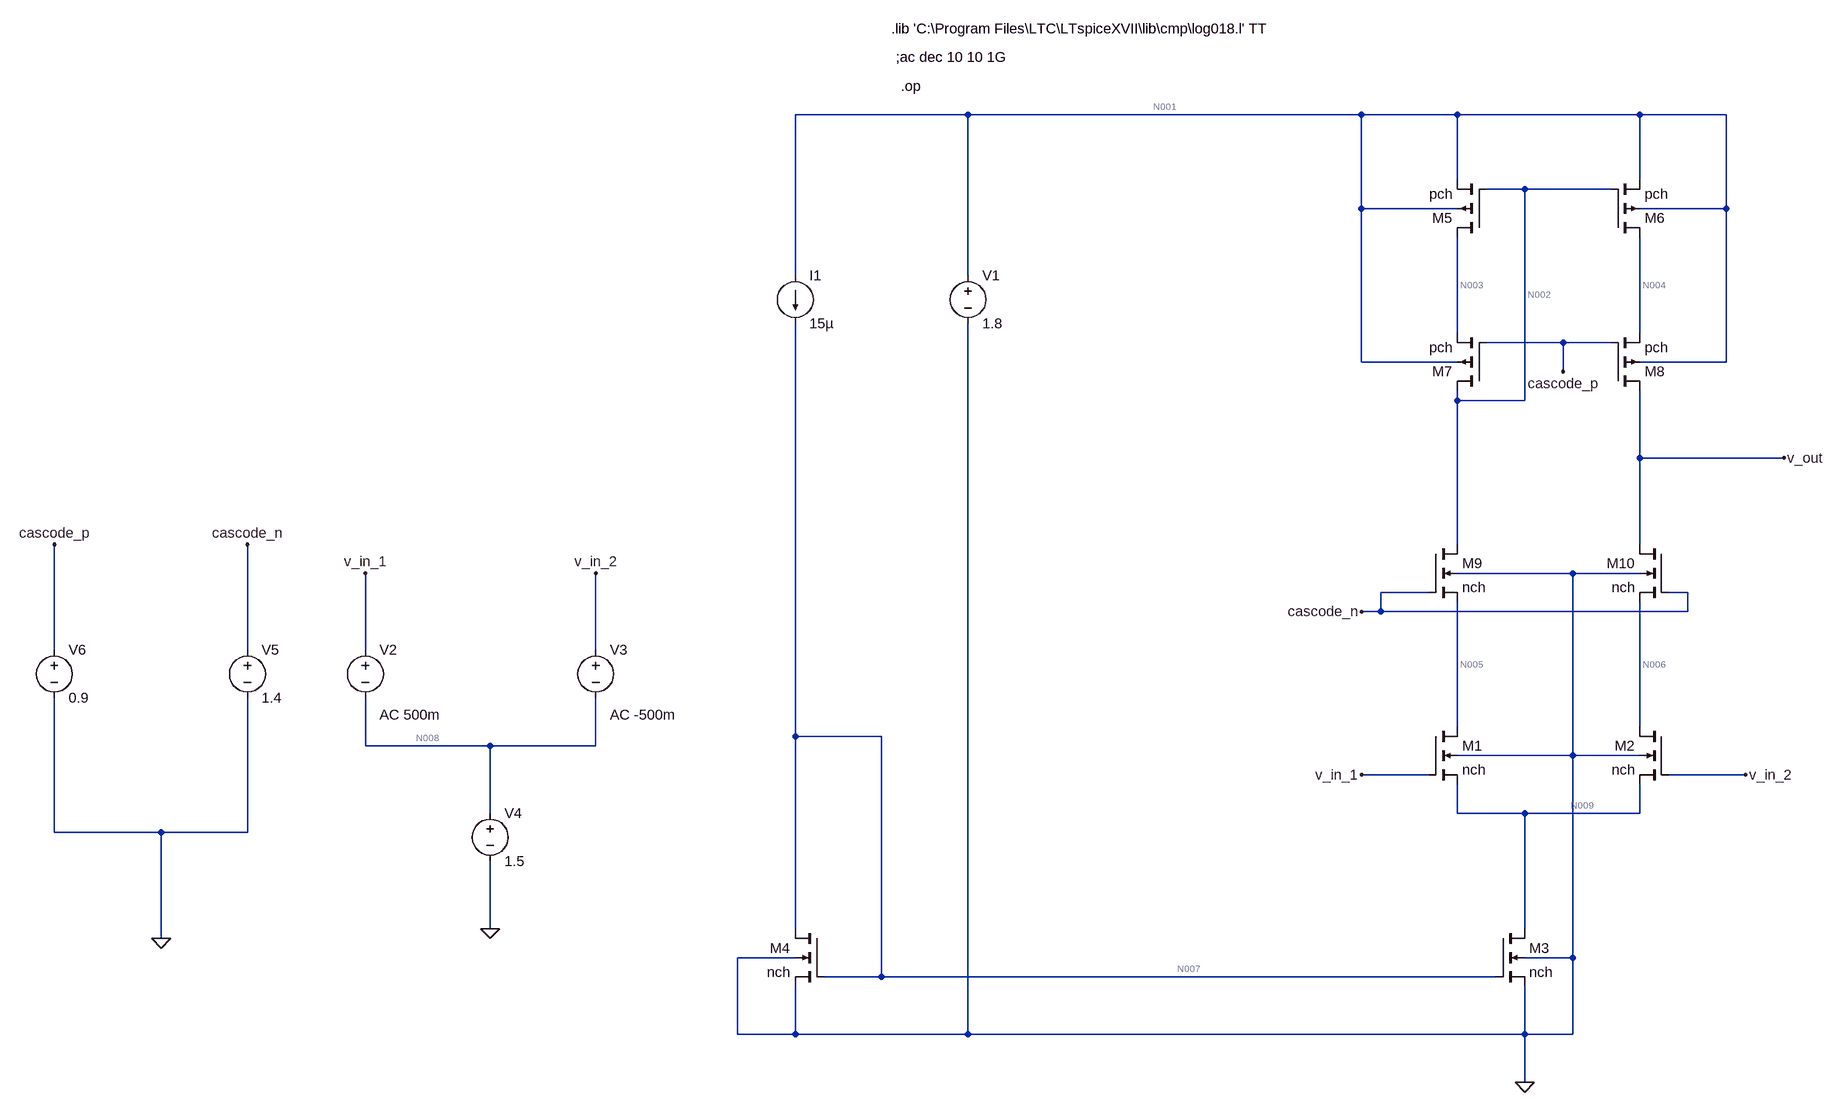
[diagram p0: schematic differential-pair-current-mirror.asc]
differential-pair-current-mirror.asc, the LTspice schematic file:
Version 4
SHEET 1 1744 1748
WIRE -208 48 -496 48
WIRE 448 48 -208 48
WIRE 608 48 448 48
WIRE 912 48 608 48
WIRE 1056 48 912 48
WIRE 608 176 608 48
WIRE 912 176 912 48
WIRE 720 192 656 192
WIRE 864 192 720 192
WIRE 448 224 448 48
WIRE 608 224 448 224
WIRE 1056 224 1056 48
WIRE 1056 224 912 224
WIRE -496 336 -496 48
WIRE -208 336 -208 48
WIRE 608 432 608 272
WIRE 912 432 912 272
WIRE 784 448 656 448
WIRE 864 448 784 448
WIRE 448 480 448 224
WIRE 608 480 448 480
WIRE 1056 480 1056 224
WIRE 1056 480 912 480
WIRE 784 496 784 448
WIRE 608 544 608 528
WIRE 720 544 720 192
WIRE 720 544 608 544
WIRE 912 640 912 528
WIRE 1152 640 912 640
WIRE 608 816 608 544
WIRE 912 816 912 640
WIRE 800 864 608 864
WIRE 912 864 800 864
WIRE 560 896 480 896
WIRE 992 896 960 896
WIRE 480 928 480 896
WIRE 480 928 448 928
WIRE 992 928 992 896
WIRE 992 928 480 928
WIRE -2048 992 -2048 816
WIRE -1696 992 -1696 816
WIRE -1376 992 -1376 864
WIRE -992 992 -992 864
WIRE 608 1120 608 912
WIRE 912 1120 912 912
WIRE -496 1136 -496 416
WIRE -352 1136 -496 1136
WIRE -1376 1152 -1376 1072
WIRE -1168 1152 -1376 1152
WIRE -992 1152 -992 1072
WIRE -992 1152 -1168 1152
WIRE 800 1168 800 864
WIRE 800 1168 608 1168
WIRE 912 1168 800 1168
WIRE 560 1200 448 1200
WIRE 1088 1200 960 1200
WIRE -1168 1264 -1168 1152
WIRE 608 1264 608 1216
WIRE 720 1264 608 1264
WIRE 912 1264 912 1216
WIRE 912 1264 720 1264
WIRE -2048 1296 -2048 1072
WIRE -1840 1296 -2048 1296
WIRE -1696 1296 -1696 1072
WIRE -1696 1296 -1840 1296
WIRE -1168 1472 -1168 1344
WIRE -496 1472 -496 1136
WIRE 720 1472 720 1264
WIRE -1840 1488 -1840 1296
WIRE -496 1520 -592 1520
WIRE 800 1520 800 1168
WIRE 800 1520 720 1520
WIRE -352 1552 -352 1136
WIRE -352 1552 -448 1552
WIRE 672 1552 -352 1552
WIRE -592 1648 -592 1520
WIRE -496 1648 -496 1568
WIRE -496 1648 -592 1648
WIRE -208 1648 -208 416
WIRE -208 1648 -496 1648
WIRE 720 1648 720 1568
WIRE 720 1648 -208 1648
WIRE 800 1648 800 1520
WIRE 800 1648 720 1648
WIRE 720 1728 720 1648
FLAG 720 1728 0
FLAG -1168 1472 0
FLAG 448 1200 v_in_1
FLAG 1088 1200 v_in_2
FLAG -1376 864 v_in_1
FLAG -992 864 v_in_2
FLAG 1152 640 v_out
FLAG 784 496 cascode_p
FLAG 448 928 cascode_n
FLAG -2048 816 cascode_p
FLAG -1696 816 cascode_n
FLAG -1840 1488 0
DATAFLAG 784 448 ""
DATAFLAG 512 1200 ""
DATAFLAG 1040 1200 ""
DATAFLAG 768 1264 ""
DATAFLAG 512 896 ""
DATAFLAG 624 1552 ""
DATAFLAG -432 1136 ""
DATAFLAG 608 624 ""
DATAFLAG 912 608 ""
DATAFLAG 608 1024 ""
DATAFLAG 608 352 ""
DATAFLAG 912 336 ""
DATAFLAG 912 1024 ""
DATAFLAG -496 1456 "Id(M4)"
DATAFLAG 720 1392 "Id(M3)"
SYMBOL nmos4 560 1120 R0
SYMATTR InstName M1
SYMATTR Value nch
SYMATTR Value2 l=1u w=15u
SYMBOL nmos4 960 1120 M0
SYMATTR InstName M2
SYMATTR Value nch
SYMATTR Value2 l=1u w=15u
SYMBOL nmos4 672 1472 R0
SYMATTR InstName M3
SYMATTR Value nch
SYMATTR Value2 l=1u w=30u
SYMBOL nmos4 -448 1472 M0
SYMATTR InstName M4
SYMATTR Value nch
SYMATTR Value2 l=1u w=15u
SYMBOL pmos4 656 272 R180
SYMATTR InstName M5
SYMATTR Value pch
SYMATTR Value2 l=1u w=15u
SYMBOL pmos4 864 272 M180
SYMATTR InstName M6
SYMATTR Value pch
SYMATTR Value2 l=1u w=15u
SYMBOL current -496 336 R0
SYMATTR InstName I1
SYMATTR Value 15µ
SYMBOL voltage -208 320 R0
WINDOW 123 0 0 Left 0
WINDOW 39 0 0 Left 0
SYMATTR InstName V1
SYMATTR Value 1.8
SYMBOL voltage -1376 976 R0
WINDOW 123 24 124 Left 2
WINDOW 39 0 0 Left 0
SYMATTR Value2 AC 500m
SYMATTR InstName V2
SYMATTR Value ""
SYMBOL voltage -1168 1248 R0
WINDOW 123 0 0 Left 0
WINDOW 39 0 0 Left 0
SYMATTR InstName V4
SYMATTR Value 1.5
SYMBOL voltage -992 976 R0
WINDOW 123 24 124 Left 2
WINDOW 39 0 0 Left 0
SYMATTR Value2 AC -500m
SYMATTR InstName V3
SYMATTR Value ""
SYMBOL pmos4 656 528 R180
SYMATTR InstName M7
SYMATTR Value pch
SYMATTR Value2 l=1u w=15u
SYMBOL pmos4 864 528 M180
SYMATTR InstName M8
SYMATTR Value pch
SYMATTR Value2 l=1u w=15u
SYMBOL nmos4 560 816 R0
SYMATTR InstName M9
SYMATTR Value nch
SYMATTR Value2 l=1u w=15u
SYMBOL nmos4 960 816 M0
SYMATTR InstName M10
SYMATTR Value nch
SYMATTR Value2 l=1u w=15u
SYMBOL voltage -1696 976 R0
SYMATTR InstName V5
SYMATTR Value 1.4
SYMBOL voltage -2048 976 R0
WINDOW 123 0 0 Left 0
WINDOW 39 0 0 Left 0
SYMATTR InstName V6
SYMATTR Value 0.9
TEXT -336 -96 Left 2 !.lib 'C:\\Program Files\\LTC\\LTspiceXVII\\lib\\cmp\\log018.l' TT
TEXT -328 -48 Left 2 !;ac dec 10 10 1G
TEXT -320 0 Left 2 !.op

The netlist it stands for:
* differential-pair-current-mirror.asc
M1 N005 v_in_1 N009 0 nch l=1u w=15u
M2 N006 v_in_2 N009 0 nch l=1u w=15u
M3 N009 N007 0 0 nch l=1u w=30u
M4 N007 N007 0 0 nch l=1u w=15u
M5 N003 N002 N001 N001 pch l=1u w=15u
M6 N004 N002 N001 N001 pch l=1u w=15u
I1 N001 N007 15µ
V1 N001 0 1.8
V2 v_in_1 N008 AC 500m
V4 N008 0 1.5
V3 v_in_2 N008 AC -500m
M7 N002 cascode_p N003 N001 pch l=1u w=15u
M8 v_out cascode_p N004 N001 pch l=1u w=15u
M9 N002 cascode_n N005 0 nch l=1u w=15u
M10 v_out cascode_n N006 0 nch l=1u w=15u
V5 cascode_n 0 1.4
V6 cascode_p 0 0.9
.model NMOS NMOS
.model PMOS PMOS
.lib standard.mos
.lib 'C:\Program Files\LTC\LTspiceXVII\lib\cmp\log018.l' TT
;ac dec 10 10 1G
.op
.backanno
.end

* Results of the author's LTspice run, read from the files saved beside the schematic
* Operating Point:
*   V(n005) = 720.9 mV
*   V(v_in_1) = 1.5 V
*   V(n009) = 700.9 mV
*   V(n006) = 720.9 mV
*   V(v_in_2) = 1.5 V
*   V(n007) = 499.4 mV
*   V(n003) = 1.589 V
*   V(n002) = 1.174 V
*   V(n001) = 1.8 V
*   V(n004) = 1.589 V
*   V(n008) = 1.5 V
*   V(cascode_p) = 900 mV
*   V(v_out) = 1.174 V
*   V(cascode_n) = 1.4 V
*   Id(M8) = -15.27 µA
*   Ig(M8) = 0 A
*   Ib(M8) = 857.1 fA
*   Is(M8) = 15.27 µA
*   Id(M7) = -15.27 µA
*   Ig(M7) = 0 A
*   Ib(M7) = 857.1 fA
*   Is(M7) = 15.27 µA
*   Id(M6) = -15.27 µA
*   Ig(M6) = 0 A
*   Ib(M6) = 220.9 fA
*   Is(M6) = 15.27 µA
*   Id(M5) = -15.27 µA
*   Ig(M5) = 0 A
*   Ib(M5) = 220.9 fA
*   Is(M5) = 15.27 µA
*   Id(M10) = 15.27 µA
*   Ig(M10) = 0 A
*   Ib(M10) = -1.915 pA
*   Is(M10) = -15.27 µA
*   Id(M9) = 15.27 µA
*   Ig(M9) = 0 A
*   Ib(M9) = -1.915 pA
*   Is(M9) = -15.27 µA
*   Id(M4) = 15 µA
*   Ig(M4) = 0 A
*   Ib(M4) = -509.4 fA
*   Is(M4) = -15 µA
*   Id(M3) = 30.54 µA
*   Ig(M3) = 0 A
*   Ib(M3) = -754 fA
*   Is(M3) = -30.54 µA
*   Id(M2) = 15.27 µA
*   Ig(M2) = 0 A
*   Ib(M2) = -1.442 pA
*   Is(M2) = -15.27 µA
*   Id(M1) = 15.27 µA
*   Ig(M1) = 0 A
*   Ib(M1) = -1.442 pA
*   Is(M1) = -15.27 µA
*   I(I1) = 15 µA
*   I(V6) = 0 A
*   I(V5) = 0 A
*   I(V3) = 0 A
*   I(V4) = 0 A
*   I(V2) = 0 A
*   I(V1) = -45.54 µA
* From the log:
*   Semiconductor Device Operating Points:
*                           --- BSIM3 MOSFETS ---
*   Name:        m8          m7          m6          m5          m10
*   Model:      pch.2       pch.2       pch.2       pch.2       nch.2
*   Id:       -1.53e-05   -1.53e-05   -1.53e-05   -1.53e-05    1.53e-05
*   Vgs:      -6.89e-01   -6.89e-01   -6.26e-01   -6.26e-01    6.79e-01
*   Vds:      -4.15e-01   -4.15e-01   -2.11e-01   -2.11e-01    4.53e-01
*   Vbs:       2.11e-01    2.11e-01    0.00e+00    0.00e+00   -7.21e-01
*   Vth:      -5.22e-01   -5.22e-01   -4.57e-01   -4.57e-01    6.58e-01
*   Vdsat:    -1.75e-01   -1.75e-01   -1.73e-01   -1.73e-01    9.85e-02
*   Gm:        1.47e-04    1.47e-04    1.42e-04    1.42e-04    2.64e-04
*   Gds:       1.09e-06    1.09e-06    7.84e-06    7.84e-06    1.16e-06
*   Gmb        4.45e-05    4.45e-05    4.68e-05    4.68e-05    5.71e-05
*   Cbd:       0.00e+00    0.00e+00    0.00e+00    0.00e+00    0.00e+00
*   Cbs:       0.00e+00    0.00e+00    0.00e+00    0.00e+00    0.00e+00
*   Cgsov:     4.91e-15    4.91e-15    4.91e-15    4.91e-15    5.49e-15
*   Cgdov:     4.91e-15    4.91e-15    4.91e-15    4.91e-15    5.49e-15
*   Cgbov:     2.73e-16    2.73e-16    2.73e-16    2.73e-16    1.81e-16
*   dQgdVgb:   1.01e-13    1.01e-13    1.03e-13    1.03e-13    6.95e-14
*   dQgdVdb:  -5.03e-15   -5.03e-15   -6.28e-15   -6.28e-15   -5.49e-15
*   dQgdVsb:  -9.12e-14   -9.12e-14   -9.12e-14   -9.12e-14   -5.17e-14
*   dQddVgb:  -5.44e-15   -5.44e-15   -8.26e-15   -8.26e-15   -5.63e-15
*   dQddVdb:   5.22e-15    5.22e-15    8.18e-15    8.18e-15    5.52e-15
*   dQddVsb:   3.72e-16    3.72e-16    1.19e-15    1.19e-15    1.45e-16
*   dQbdVgb:  -1.43e-14   -1.43e-14   -1.42e-14   -1.42e-14   -1.19e-14
*   dQbdVdb:  -7.16e-17   -7.16e-17   -7.96e-16   -7.96e-16   -1.28e-18
*   dQbdVsb:  -1.30e-14   -1.30e-14   -1.56e-14   -1.56e-14   -1.04e-14
*   Name:        m9          m4          m3          m2          m1
*   Model:      nch.2       nch.2       nch.2       nch.2       nch.2
*   Id:        1.53e-05    1.50e-05    3.05e-05    1.53e-05    1.53e-05
*   Vgs:       6.79e-01    4.99e-01    4.99e-01    7.99e-01    7.99e-01
*   Vds:       4.53e-01    4.99e-01    7.01e-01    2.00e-02    2.00e-02
*   Vbs:      -7.21e-01    0.00e+00    0.00e+00   -7.01e-01   -7.01e-01
*   Vth:       6.58e-01    4.81e-01    4.81e-01    6.54e-01    6.54e-01
*   Vdsat:     9.85e-02    9.47e-02    9.48e-02    1.89e-01    1.89e-01
*   Gm:        2.64e-04    2.58e-04    5.24e-04    9.76e-05    9.76e-05
*   Gds:       1.16e-06    1.07e-06    1.89e-06    7.17e-04    7.17e-04
*   Gmb        5.71e-05    7.47e-05    1.53e-04    2.19e-05    2.19e-05
*   Cbd:       0.00e+00    0.00e+00    0.00e+00    0.00e+00    0.00e+00
*   Cbs:       0.00e+00    0.00e+00    0.00e+00    0.00e+00    0.00e+00
*   Cgsov:     5.49e-15    5.49e-15    1.10e-14    5.49e-15    5.49e-15
*   Cgdov:     5.49e-15    5.49e-15    1.10e-14    5.49e-15    5.49e-15
*   Cgbov:     1.81e-16    1.81e-16    1.81e-16    1.81e-16    1.81e-16
*   dQgdVgb:   6.95e-14    7.03e-14    1.41e-13    1.23e-13    1.23e-13
*   dQgdVdb:  -5.49e-15   -5.49e-15   -1.10e-14   -5.24e-14   -5.24e-14
*   dQgdVsb:  -5.17e-14   -4.81e-14   -9.66e-14   -6.98e-14   -6.98e-14
*   dQddVgb:  -5.63e-15   -5.60e-15   -1.11e-14   -5.87e-14   -5.87e-14
*   dQddVdb:   5.52e-15    5.51e-15    1.10e-14    9.39e-14    9.39e-14
*   dQddVsb:   1.45e-16    1.21e-16    1.29e-16   -2.39e-14   -2.39e-14
*   dQbdVgb:  -1.19e-14   -1.52e-14   -3.03e-14   -1.12e-15   -1.12e-15
*   dQbdVdb:  -1.28e-18   -4.56e-19    2.95e-18   -1.20e-14   -1.20e-14
*   dQbdVsb:  -1.04e-14   -1.43e-14   -2.91e-14   -1.15e-14   -1.15e-14